# Altium project GATEWAY.PRJPCB
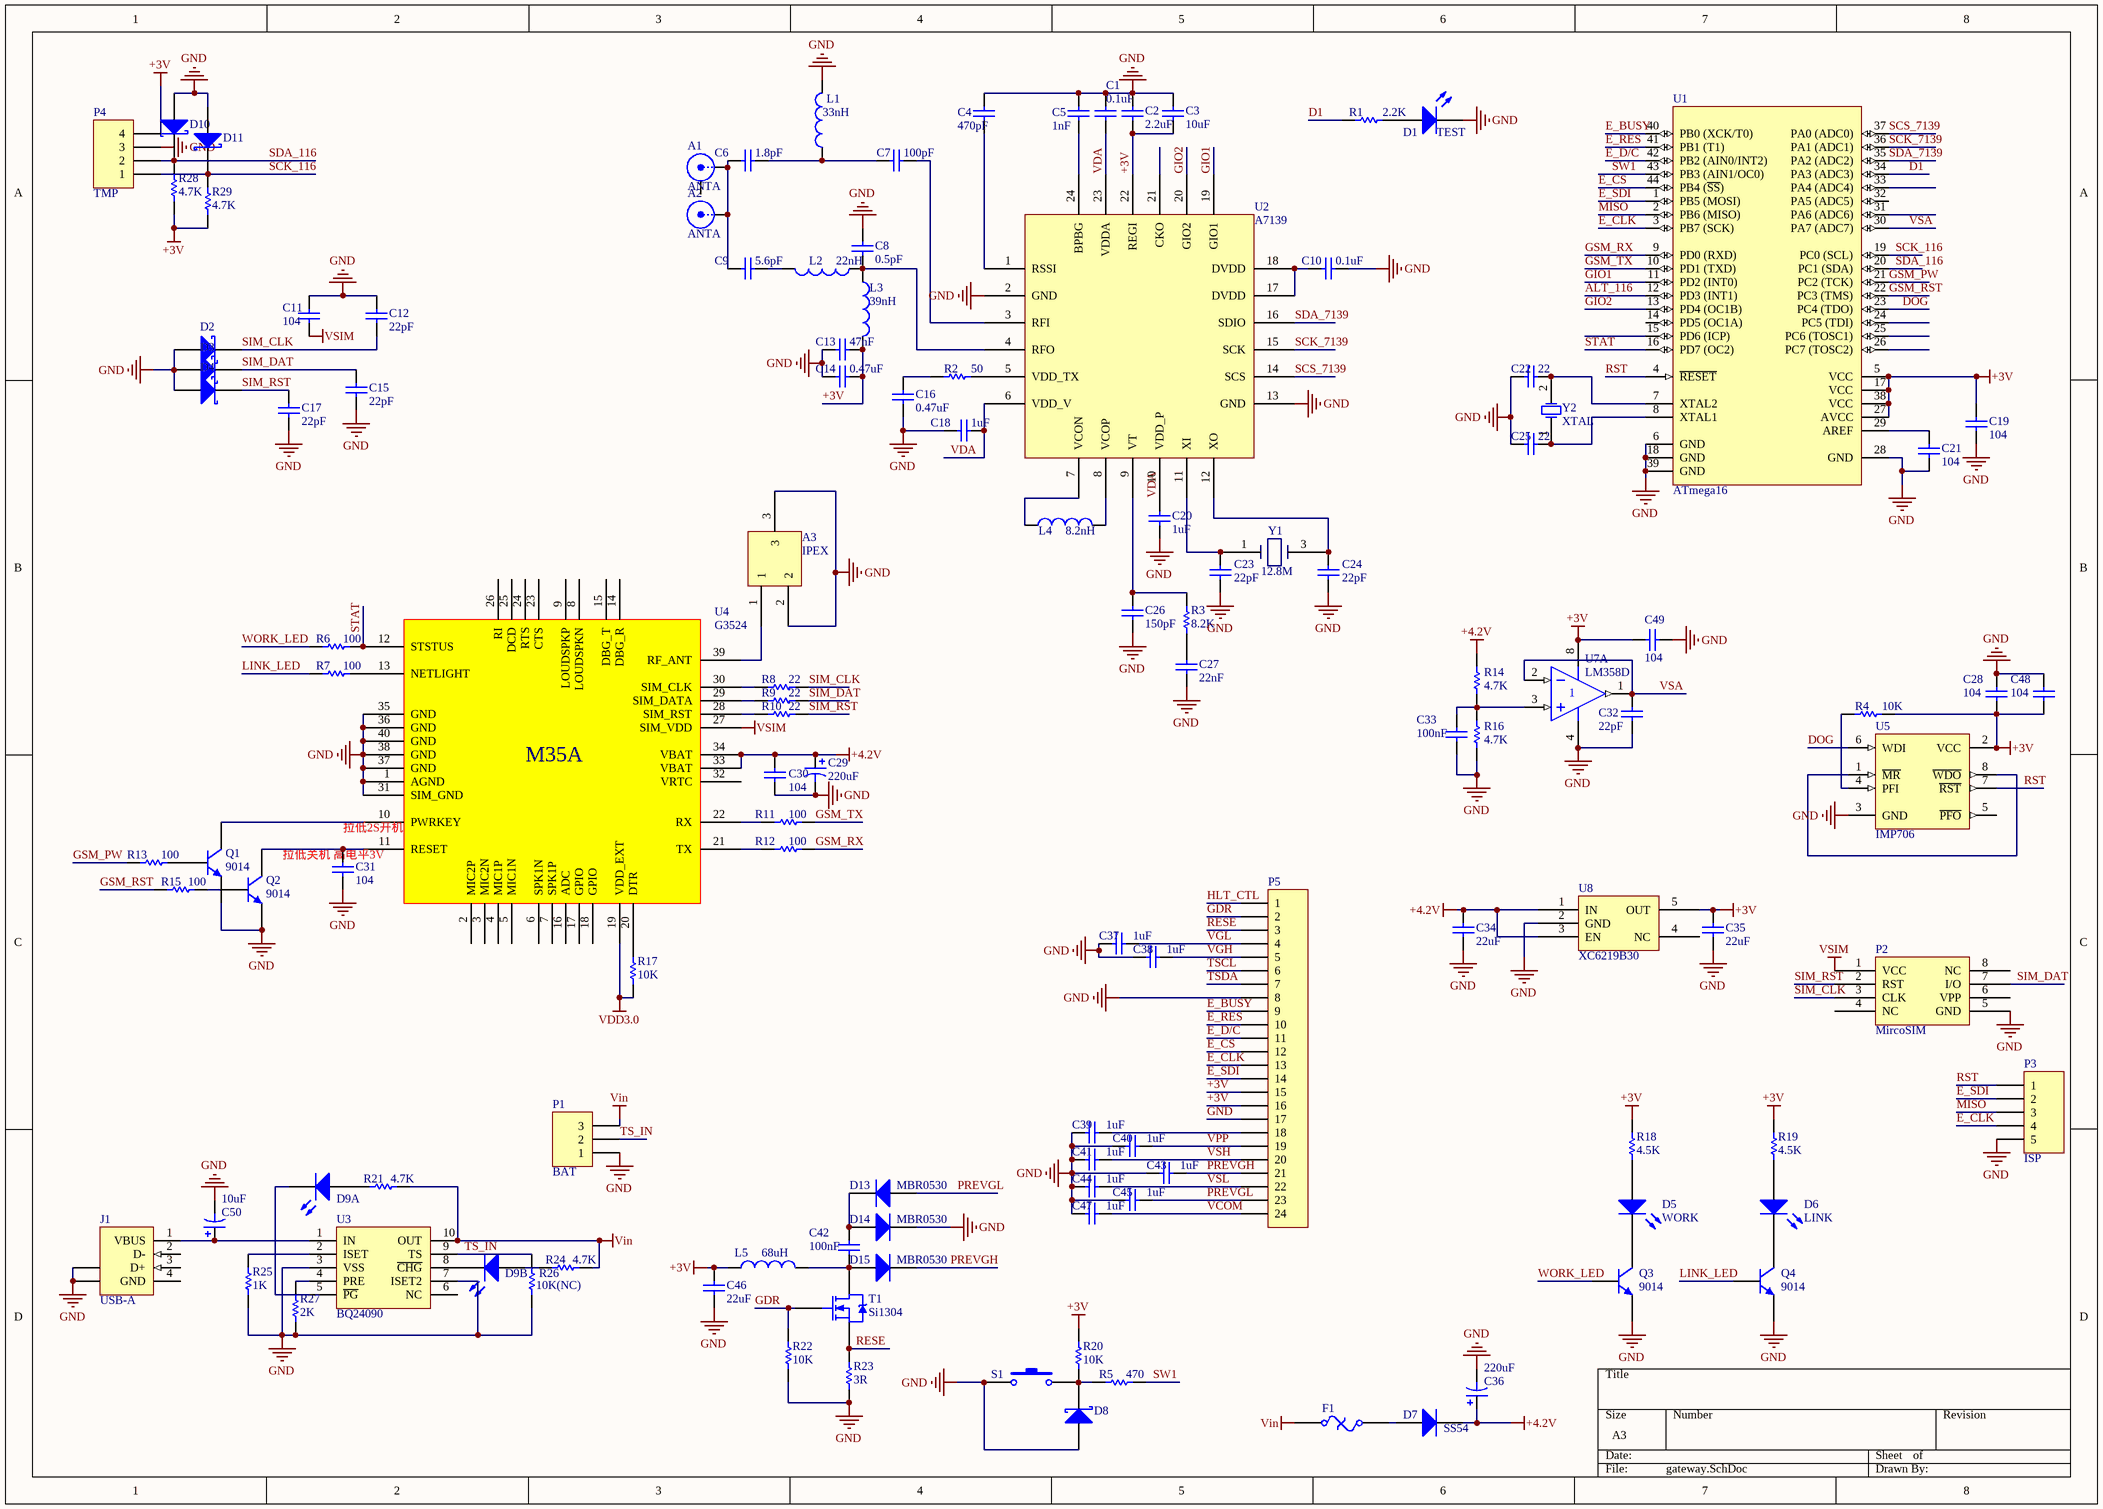
[diagram p0: gateway.SchDoc]
1 sheet, 123 parts. Net scope: global (net labels, ports and power ports of the same name join across sheets).
Board file: gateway.PcbDoc

## Sheet gateway.SchDoc
size A3

### Parts
A1  ANTA  [ANTA-433]
A2  ANTA  [IPEX]
A3  IPEX  [IPEX]
C1  value 0.1uF  [0402-A]  (hidden comment: Cap)
C2  value 2.2uF  [0603]  (hidden comment: Cap)
C3  value 10uF  [0603]  (hidden comment: Cap)
C4  value 470pF  [0402-A]  (hidden comment: Cap)
C5  value 1nF  [0402-A]  (hidden comment: Cap)
C6  value 1.8pF  [0402-A]  (hidden comment: Cap)
C7  value 100pF  [0402-A]  (hidden comment: Cap)
C8  value 0.5pF  [0402-A]  (hidden comment: Cap)
C9  value 5.6pF  [0402-A]  (hidden comment: Cap)
C10  value 0.1uF  [0402-A]  (hidden comment: Cap)
C11  value 104  [0603]  (hidden comment: Cap)
C12  value 22pF  [0603]  (hidden comment: Cap)
C13  value 47nF  [0402-A]  (hidden comment: Cap)
C14  value 0.47uF  [0402-A]  (hidden comment: Cap)
C15  value 22pF  [0603]  (hidden comment: Cap)
C16  value 0.47uF  [0402-A]  (hidden comment: Cap)
C17  value 22pF  [0603]  (hidden comment: Cap)
C18  value 1uF  [0402-A]  (hidden comment: Cap)
C19  value 104  [0603]  (hidden comment: Cap)
C20  value 1uF  [0402-A]  (hidden comment: Cap)
C21  value 104  [0603]  (hidden comment: Cap)
C22  value 22  [0603]  (hidden comment: Cap)
C23  value 22pF  [0402-A]  (hidden comment: Cap)
C24  value 22pF  [0402-A]  (hidden comment: Cap)
C25  value 22  [0603]  (hidden comment: Cap)
C26  value 150pF  [0402-A]  (hidden comment: Cap)
C27  value 22nF  [0402-A]  (hidden comment: Cap)
C28  value 104  [0603]  (hidden comment: Cap)
C29  value 220uF  [C7343]  (hidden comment: Cap Pol3)
C30  value 104  [0603]  (hidden comment: Cap)
C31  value 104  [0603]  (hidden comment: Cap)
C32  value 22pF  [0603]  (hidden comment: Cap)
C33  value 100nF  [0603]  (hidden comment: Cap)
C34  value 22uF  [3216[1206]]  (hidden comment: Cap)
C35  value 22uF  [3216[1206]]  (hidden comment: Cap)
C36  value 220uF  [C7343]  (hidden comment: Cap Pol3)
C37  value 1uF  [0603]  (hidden comment: Cap)
C38  value 1uF  [0603]  (hidden comment: Cap)
C39  value 1uF  [0603]  (hidden comment: Cap)
C40  value 1uF  [0603]  (hidden comment: Cap)
C41  value 1uF  [0603]  (hidden comment: Cap)
C42  value 100nF  [0603]  (hidden comment: Cap)
C43  value 1uF  [0603]  (hidden comment: Cap)
C44  value 1uF  [0603]  (hidden comment: Cap)
C45  value 1uF  [0603]  (hidden comment: Cap)
C46  value 22uF  [3216[1206]]  (hidden comment: Cap)
C47  value 1uF  [0603]  (hidden comment: Cap)
C48  value 104  [0603]  (hidden comment: Cap)
C49  value 104  [0603]  (hidden comment: Cap)
C50  value 10uF  [0805]  (hidden comment: Cap Pol3)
D1  TEST  [0603-LED]
D2  RL0603E012M100K  [0603]  (value not drawn)
D3  RL0603E012M100K  [0603]  (value not drawn)
D4  RL0603E012M100K  [0603]  (value not drawn)
D5  WORK  [0603-LED]
D6  LINK  [0603-LED]
D7  SS54  [SMA]
D8  RL0603E012M100K  [0603]  (value not drawn)
D9  LED  [0603-LED-DOUBLE]  (value not drawn)  (parts A,B of 2)
D10  RL0603E012M100K  [0603]  (value not drawn)
D11  RL0603E012M100K  [0603]  (value not drawn)
D13  MBR0530  [SOD-123]
D14  MBR0530  [SOD-123]
D15  MBR0530  [SOD-123]
F1  Fuse Thermal  [1812]  (value not drawn)
J1  USB-A  [MicroUSB]
L1  value 33nH  [0603]  (hidden comment: Inductor)
L2  value 22nH  [0603]  (hidden comment: Inductor)
L3  value 39nH  [0603]  (hidden comment: Inductor)
L4  value 8.2nH  [0402-A]  (hidden comment: Inductor)
L5  value 68uH  [14-1210]  (hidden comment: Inductor)
P1  BAT  [1.25-3P]
P2  MircoSIM  [Micro SIM]
P3  ISP  [HDR1X5]
P4  TMP  [1.25-4P]
P5  Header 24  [FPC-24]  (value not drawn)
Q1  value 9014  [SOT-23-NPN]  (hidden comment: NPN)
Q2  value 9014  [SOT-23-NPN]  (hidden comment: NPN)
Q3  value 9014  [SOT-23-NPN]  (hidden comment: NPN)
Q4  value 9014  [SOT-23-NPN]  (hidden comment: NPN)
R1  value 2.2K  [0603]  (hidden comment: Res1)
R2  value 50  [0402-A]  (hidden comment: Res1)
R3  value 8.2K  [0402-A]  (hidden comment: Res1)
R4  value 10K  [0603]  (hidden comment: Res1)
R5  value 470  [0603]  (hidden comment: Res1)
R6  value 100  [0603]  (hidden comment: Res1)
R7  value 100  [0603]  (hidden comment: Res1)
R8  value 22  [0603]  (hidden comment: Res1)
R9  value 22  [0603]  (hidden comment: Res1)
R10  value 22  [0603]  (hidden comment: Res1)
R11  value 100  [0603]  (hidden comment: Res1)
R12  value 100  [0603]  (hidden comment: Res1)
R13  value 100  [0603]  (hidden comment: Res1)
R14  value 4.7K  [0603]  (hidden comment: Res1)
R15  value 100  [0603]  (hidden comment: Res1)
R16  value 4.7K  [0603]  (hidden comment: Res1)
R17  value 10K  [0603]  (hidden comment: Res1)
R18  value 4.5K  [0603]  (hidden comment: Res1)
R19  value 4.5K  [0603]  (hidden comment: Res1)
R20  value 10K  [0603]  (hidden comment: Res1)
R21  value 4.7K  [0603]  (hidden comment: Res1)
R22  value 10K  [0603]  (hidden comment: Res1)
R23  value 3R  [0603]  (hidden comment: Res1)
R24  value 4.7K  [0603]  (hidden comment: Res1)
R25  value 1K  [0603]  (hidden comment: Res1)
R26  value 10K(NC)  [0603]  (hidden comment: Res1)
R27  value 2K  [0603]  (hidden comment: Res1)
R28  value 4.7K  [0603]  (hidden comment: Res1)
R29  value 4.7K  [0603]  (hidden comment: Res1)
S1  SW-PB  [SW1]  (value not drawn)
T1  Si1304  [SOT-23-NMOS]
U1  ATmega16  [44A_M]
U2  A7139  [QFN24N]
U3  BQ24090  [MSOP-PowerPAD-10]
U4  G3524  [G3524]
U5  IMP706  [SOIC8]
U7  LM358D  [SOIC8]  (part A of 2)
U8  XC6219B30  [SOT23-5N]
Y1  12.8M  [XT3225]
Y2  XTAL  [XT5032]

### Nets
+3V: C2.1 C3.1 C13.2 C14.2 C19.1 C28.2 C35.1 C46.1 C48.2 C49.1 L3.2 L5.1 P4.4 P5.15 P5.16 R4.2 R18.1 R19.1 R20.1 R28.2 R29.2 U1.5(VCC) U1.17(VCC) U1.27(AVCC) U1.38(VCC) U2.22(REGI) U5.2(VCC) U7.8(V+) U8.5(OUT)
+4.2V: C29.1 C30.2 C34.1 C36.1 D7.2(K) R14.2 U4.33(VBAT) U4.34(VBAT) U8.1(IN) U8.3(EN)
GND: A2.2(Y) A3.2 A3.3 C1.2 C2.2 C3.2 C4.2 C5.2 C8.2 C10.2 C11.1 C12.1 C13.1 C14.1 C15.2 C16.1 C17.2 C18.2 C19.2 C20.1 C21.2 C22.2 C23.1 C24.1 C25.2 C26.1 C27.2 C28.1 C29.2 C30.1 C31.2 C32.1 C33.2 C34.2 C35.2 C36.2 C37.1 C38.1 C39.1 C40.1 C41.1 C43.1 C44.1 C45.1 C46.2 C47.1 C48.1 C49.2 C50.2 D1.2(K) D2.2(A) D3.2(A) D4.2(A) D8.2(A) D10.2(A) D11.2(A) D14.2(K) J1.5(SHLD) J1.6(SHLD) L1.2 P1.1 P2.5(GND) P3.5 P4.3 P5.8 P5.17 Q1.1(E) Q2.1(E) Q3.1(E) Q4.1(E) R16.1 R22.2 R23.2 R25.1 R26.1 R27.1 S1.1 U1.6(GND) U1.18(GND) U1.28(GND) U1.39(GND) U2.2(GND) U2.13(GND) U2.25(GND) U3.3(VSS) U3.7(ISET2) U3.11 U4.1(AGND) U4.31(SIM_GND) U4.35(GND) U4.36(GND) U4.37(GND) U4.38(GND) U4.40(GND) U5.3(GND) U7.4(V-) U8.2(GND)
VDD3.0: R17.2 U4.19(VDD_EXT)
Vin: F1.1 P1.3 R21.2 R24.2 U3.10(OUT)
VSIM: C11.2 P2.1(VCC) U4.27(SIM_VDD)
ALT_116: U1.12(PD3_(INT1))
D1: R1.1 U1.34(PA3_(ADC3))
DOG: U1.23(PC4_(TDO)) U5.6(WDI)
E_BUSY: P5.9 U1.40(PB0_(XCK/T0))
E_CLK: P3.4 P5.13 U1.3(PB7_(SCK))
E_CS: P5.12 U1.44(PB4_(~{SS}))
E_D/C: P5.11 U1.42(PB2_(AIN0/INT2))
E_RES: P5.10 U1.41(PB1_(T1))
E_SDI: P3.2 P5.14 U1.1(PB5_(MOSI))
GDR: P5.2 R22.1 T1.1(G)
GIO1: U1.11(PD2_(INT0)) U2.19(GIO1)
GIO2: U1.13(PD4_(OC1B)) U2.20(GIO2)
GSM_PW: R13.2 U1.21(PC2_(TCK))
GSM_RST: R15.2 U1.22(PC3_(TMS))
GSM_RX: R12.2 U1.9(PD0_(RXD))
GSM_TX: R11.2 U1.10(PD1_(TXD))
HLT_CTL: P5.1
LINK_LED: Q4.2(B) R7.2
MISO: P3.3 U1.2(PB6_(MISO))
PREVGH: C43.2 D15.2(K) P5.21
PREVGL: C45.2 D13.1(A) P5.23
RESE: P5.3 R23.1 T1.3(S)
RST: P3.1 U1.4(~{RESET}) U5.7(~{RST})
SCK_116: D11.1(K) P4.1 R29.1 U1.19(PC0_(SCL))
SCK_7139: U1.36(PA1_(ADC1)) U2.15(SCK)
SCS_7139: U1.37(PA0_(ADC0)) U2.14(SCS)
SDA_116: D10.1(K) P4.2 R28.1 U1.20(PC1_(SDA))
SDA_7139: U1.35(PA2_(ADC2)) U2.16(SDIO)
SIM_CLK: C12.2 D2.1(K) P2.3(CLK) R8.1
SIM_DAT: C15.1 D3.1(K) P2.7(I/O) R9.1
SIM_RST: C17.1 D4.1(K) P2.2(RST) R10.1
STAT: R6.1 U1.16(PD7_(OC2)) U4.12(STSTUS)
SW1: R5.2 U1.43(PB3_(AIN1/OC0))
TS_IN: P1.2 R26.2 U3.9(TS)
TSCL: P5.6
TSDA: P5.7
VCOM: C47.2 P5.24
VDA: C1.1 C18.1 C20.2 U2.6(VDD_V) U2.10(VDD_P) U2.23(VDDA)
VGH: C38.2 P5.5
VGL: C37.2 P5.4
VPP: C40.2 P5.19
VSA: C32.2 U1.30(PA7_(ADC7)) U7.1(OUT) U7.2(IN-)
VSH: C41.2 P5.20
VSL: C44.2 P5.22
WORK_LED: Q3.2(B) R6.2
NetA1_1: A1.1(X) A2.1(X) C6.2 C9.2
NetA3_1: A3.1 U4.39(RF_ANT)
NetC4_1: C4.1 U2.1(RSSI)
NetC5_1: C5.1 U2.24(BPBG)
NetC6_1: C6.1 C7.2 L1.1
NetC7_1: C7.1 U2.3(RFI)
NetC8_1: C8.1 L2.1 L3.1 U2.4(RFO)
NetC9_1: C9.1 L2.2
NetC10_1: C10.1 U2.17(DVDD) U2.18(DVDD)
NetC16_2: C16.2 R2.2
NetC21_1: C21.1 U1.29(AREF)
NetC22_1: C22.1 U1.7(XTAL2) Y2.2(OSC2)
NetC23_2: C23.2 U2.11(XI) Y1.1
NetC24_2: C24.2 U2.12(XO) Y1.3
NetC25_1: C25.1 U1.8(XTAL1) Y2.1(OSC1)
NetC26_2: C26.2 R3.2 U2.9(VT)
NetC27_1: C27.1 R3.1
NetC31_1: C31.1 Q2.3(C) U4.11(RESET)
NetC33_1: C33.1 R14.1 R16.2 U7.3(IN+)
NetC39_2: C39.2 P5.18
NetC42_1: C42.1 D15.1(A) L5.2 T1.2(D)
NetC42_2: C42.2 D13.2(K) D14.1(A)
NetC50_1: C50.1 J1.1(VBUS) U3.1(IN)
NetD1_1: D1.1(A) R1.2
NetD5_1: D5.1(A) R18.2
NetD5_2: D5.2(K) Q3.3(C)
NetD6_1: D6.1(A) R19.2
NetD6_2: D6.2(K) Q4.3(C)
NetD7_1: D7.1(A) F1.2
NetD8_1: D8.1(K) R5.1 R20.2 S1.2
NetD9_1: D9.1(A) R21.1
NetD9_2: D9.2(K) U3.5(~{PG})
NetD9_3: D9.3 R24.1
NetD9_4: D9.4 U3.8(~{CHG})
NetL4_1: L4.1 U2.7(VCON)
NetL4_2: L4.2 U2.8(VCOP)
NetQ1_2: Q1.2(B) R13.1
NetQ1_3: Q1.3(C) U4.10(PWRKEY)
NetQ2_2: Q2.2(B) R15.1
NetR2_1: R2.1 U2.5(VDD_TX)
NetR4_1: R4.1 U5.4(PFI)
NetR7_1: R7.1 U4.13(NETLIGHT)
NetR8_2: R8.2 U4.30(SIM_CLK)
NetR9_2: R9.2 U4.29(SIM_DATA)
NetR10_2: R10.2 U4.28(SIM_RST)
NetR11_1: R11.1 U4.22(RX)
NetR12_1: R12.1 U4.21(TX)
NetR17_1: R17.1 U4.20(DTR)
NetR25_2: R25.2 U3.2(ISET)
NetR27_2: R27.2 U3.4(PRE)
NetU5_1: U5.1(~{MR}) U5.8(~{WDO})

Not connected (* = marked no-connect by the designer): A1 2(Y); J1 2(D-) 3(D+) 4(GND); P2 4(NC) 6(VPP) 8(NC); U1 14(PD5_(OC1A)) 15(PD6_(ICP)) 24(PC5_(TDI)) 25(PC6_(TOSC1)) 26(PC7_(TOSC2)) 31(PA6_(ADC6)) 32(PA5_(ADC5)) 33(PA4_(ADC4)); U2 21(CKO); U3 6(NC); U4 2(MIC2P) 3(MIC2N) 4(MIC1P) 5(MIC1N) 6(SPK1N) 7(SPK1P) 8(LOUDSPKN) 9(LOUDSPKP) 14(DBG_R) 15(DBG_T) 16(ADC) 17(GPIO) 18(GPIO) 23(CTS) 24(RTS) 25(DCD) 26(RI) 32(VRTC); U5 5(~{PFO}); U8 4(NC)

### Notes on the sheet
- (near C31) 拉低关机 高电平3V
- 拉低2S开机
- (in symbol G3524) M35A

### Library data of the parts
A1 A2 = SMB: SMB Straight Connector; LatestRevisionDate: 17-Jul-2002; LatestRevisionNote: Re-released for DXP Platform.; Publisher: Altium Limited
C1-C28 C30-C35 C37-C49 = Cap: Capacitor; Published: 8-Jun-2000; LatestRevisionDate: 17-Jul-2002; LatestRevisionNote: Re-released for DXP Platform.; PackageReference: RAD-0.3; Publisher: Altium Limited
C29 C36 C50 = Cap Pol3: Polarized Capacitor (Surface Mount); Published: 8-Jun-2000; LatestRevisionDate: 17-Jul-2002; LatestRevisionNote: Re-released for DXP Platform.; PackageReference: C0805; Publisher: Altium Limited
D1 D5 D6 = LED2: Typical RED, GREEN, YELLOW, AMBER GaAs LED; Value: GRN; Published: 8-Jun-2000; LatestRevisionDate: 17-Jul-2002; LatestRevisionNote: Re-released for DXP Platform.; PackageDocument: Feb-2002; PackageReference: 3.2X1.6X1.1; Publisher: Altium Limited
D2-D4 D8 D10 D11 = Diode 18TQ045: Schottky Rectifier; Note: Terminal 2 is the TAB and is electrically connected to the cathode; Value: SMBJ45CA; Published: 8-Jun-2000; LatestRevisionDate: 17-Jul-2002; LatestRevisionNote: Re-released for DXP Platform.; DatasheetDocument: Dec-1997; PackageDocument: Feb-1998; PackageReference: TO-220AC; Publisher: Altium Limited; ComponentLink1Description: Manufacturer Link; ComponentLink1URL: http://www.irf.com/; ComponentLink2Description: Datasheet; ComponentLink2URL: http://www.irf.com/product-info/datasheets/data/18tq.pdf
D7 = Diode 1N5408: 3 Amp Medium Power Silicon Rectifier Diode; Published: 8-Jun-2000; LatestRevisionDate: 17-Jul-2002; LatestRevisionNote: Re-released for DXP Platform.; DatasheetDocument: Aug-1984; PackageReference: DO-201AD; Publisher: Altium Limited; ComponentLink1Description: Manufacturer Link; ComponentLink1URL: http://www.irf.com/; Value: SS54
D9 = LED-DOUBLE
D13-D15 = Diode 1N5408: 3 Amp Medium Power Silicon Rectifier Diode; Value: SS54; Published: 8-Jun-2000; LatestRevisionDate: 17-Jul-2002; LatestRevisionNote: Re-released for DXP Platform.; DatasheetDocument: Aug-1984; PackageReference: DO-201AD; Publisher: Altium Limited; ComponentLink1Description: Manufacturer Link; ComponentLink1URL: http://www.irf.com/
F1 = Fuse Thermal: Thermal Fuse; Published: 24-Mar-1999; LatestRevisionDate: 17-Jul-2002; LatestRevisionNote: Re-released for DXP Platform.; PackageReference: PIN-W2/E2.8; Publisher: Altium Limited
J1 = 440314-1: USB 1.1, Right Angle, Thru-Hole, Series A, Reverse Type, Receptacle, 4 Position, Black; ContactMaterial: Copper Alloy; ContactPlating: Gold (30); TerminationLength: 2.22mm [0.088in.]; PCB_Layout: Complies with manufacturer's recommendation.; DrillSize: Corresponds to nominal value.; PanelGround: Without; Published: 15-Jul-2004; DatasheetDocument: 08-Sep-2003; PackageDocument: 08-Sep-2003; PackageReference: 440314; Publisher: Altium Limited; HousingMaterial: Glass-Filled Thermoplastic; ComponentLink1Description: Manufacturer Link; ComponentLink1URL: http://www.tycoelectronics.com/; ComponentLink2Description: Packaging Specification; ComponentLink2URL: http://ecommas.tycoelectronics.com/commerce/DocumentDelivery/DDEController?Action=showdoc&DocId=Customer+Drawing%7F440314%7FF%7Ftif%7FEnglish%7FC_440314_F.tif
L1-L5 = Inductor: Code_IEC: 1005; Published: 8-Jun-2000; LatestRevisionDate: 17-Jul-2002; LatestRevisionNote: Re-released for DXP Platform.; PackageReference: 0402-A; Publisher: Altium Limited; Code_JEITA: 0402
P1 = Header 3: Header, 3-Pin; LatestRevisionDate: 17-Jul-2002; LatestRevisionNote: Re-released for DXP Platform.; Publisher: Altium Limited
P3 = Header 5: Header, 5-Pin; LatestRevisionDate: 17-Jul-2002; LatestRevisionNote: Re-released for DXP Platform.; Publisher: Altium Limited
P4 = Header 4: Header, 4-Pin; LatestRevisionDate: 17-Jul-2002; LatestRevisionNote: Re-released for DXP Platform.; Publisher: Altium Limited
P5 = Header 24: Header, 24-Pin; LatestRevisionDate: 17-Jul-2002; LatestRevisionNote: Re-released for DXP Platform.; Publisher: Altium Limited
Q1-Q4 = 2N5551: NPN General Purpose Amplifier; Published: 8-Jun-2000; LatestRevisionDate: 17-Jan-2003; LatestRevisionNote: PCB Footprint 'BCY-W3/D4.7' replaced; DatasheetDocument: 1997; PackageDocument: Sep-1998; PackageReference: TO-92A; Publisher: Altium Limited; ComponentLink1Description: Manufacturer Link; ComponentLink1URL: http://www.fairchildsemi.com/; ComponentLink2Description: Datasheet; ComponentLink2URL: http://www.fairchildsemi.com/ds/2N%2F2N5551.pdf
R1-R29 = Res1: Resistor; Published: 8-Jun-2000; LatestRevisionDate: 17-Jul-2002; LatestRevisionNote: Re-released for DXP Platform.; PackageReference: AXIAL-0.3; Publisher: Altium Limited
S1 = SW-PB: Switch; Published: 24-Mar-1999; LatestRevisionDate: 17-Jul-2002; LatestRevisionNote: Re-released for DXP Platform.; PackageReference: SPST-2; Publisher: Altium Limited
T1 = IRF644S: HEXFET N-Channel Power MOSFET; Published: 8-Jun-2000; LatestRevisionDate: 17-Jul-2002; LatestRevisionNote: Re-released for DXP Platform.; DatasheetVersion: PD-9.1006; PackageReference: D2PAK; Publisher: Altium Limited; PackageDescription: D2-PAK/TO-263-AB; 3 Leads (1 Cropped); Body 15.5 (inc. leads) x 10.5 mm (LxW max); ComponentLink1Description: Manufacturer Link; ComponentLink1URL: http://www.irf.com/; ComponentLink2Description: Datasheet; ComponentLink2URL: http://www.irf.com/product-info/datasheets/data/irf644s.pdf
U1 = ATmega16-16AI: 8-Bit AVR Microcontroller with 16K Bytes of In-System Programmable Flash Memory; Published: 17-Sep-2003; LatestRevisionDate: 13-Apr-2006; LatestRevisionNote: IPC-7351 Footprint Added.; DatasheetVersion: 2466E-AVR-10/02; PackageVersion: rev.B, Oct-2001; PackageReference: 44A; Publisher: Altium Limited; PackageDescription: 44-Pin Thin Quad Flat Pack 0.8 mm Pitch; ComponentLink1Description: Manufacturer Link; ComponentLink1URL: http://www.atmel.com; ComponentLink2Description: Datasheet; ComponentLink2URL: http://www.atmel.com/dyn/resources/prod_documents/doc2466.pdf
U5 = MAX706RCSA: +3V Voltage Monitoring, Low-Cost, 礟 Supervisory Circuit; Published: 16-Jan-2001; LatestRevisionDate: 13-Apr-2006; LatestRevisionNote: IPC-7351 Footprint Added.; DatasheetVersion: Sep-1995; PackageReference: NSO8; Publisher: Altium Limited; PackageDescription: 8-Pin Small Outline Integrated Circuit 1.27 mm Pitch; Code_JEDEC: MS-012-AA; Code_IPC: SOIC127P600-8; ComponentLink1Description: Manufacturer Link; ComponentLink1URL: http://www.maxim-ic.com/; ComponentLink2Description: Datasheet; ComponentLink2URL: http://pdfserv.maxim-ic.com/en/ds/MAX706P-MAX708T.pdf
U7 = LM358D: Dual Low-Power Operational Amplifier; Published: 17-Jul-2002; LatestRevisionDate: 13-Apr-2006; LatestRevisionNote: IPC-7351 Footprint Added.; DatasheetVersion: 1988; PackageReference: 751-02; Publisher: Altium Limited; PackageDescription: 8-Pin Small Outline Integrated Circuit 1.27 mm Pitch; Code_JEDEC: MS-012-AA; Code_IPC: SOIC127P600-8; ComponentLink1Description: Manufacturer Link; ComponentLink1URL: http://www.onsemi.com/site/products/parametrics/0,4446,251,00.html; ComponentLink2Description: Datasheet; ComponentLink2URL: http://www.onsemi.com/pub/Collateral/LM358-D.PDF
U8 = LP5907: Value: LP5907
Y1 = 3225-wy
Y2 = XTAL: Crystal Oscillator; Published: 8-Jun-2000; LatestRevisionDate: 17-Jul-2002; LatestRevisionNote: Re-released for DXP Platform.; PackageReference: R38; Publisher: Altium Limited